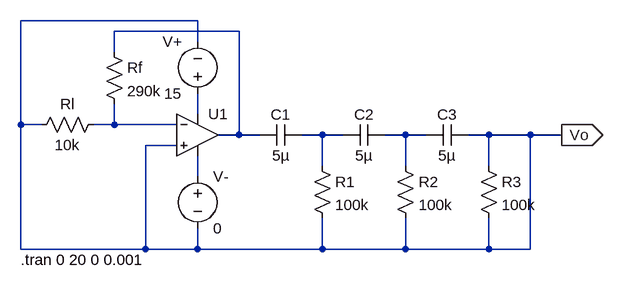
[diagram p0: schematic Oscillator - 1.asc]
Oscillator - 1.asc, the LTspice schematic file:
Version 4.1
SHEET 1 880 680
WIRE 144 -16 -128 -16
WIRE 208 0 16 0
WIRE 144 16 144 -16
WIRE 16 32 16 0
WIRE 144 128 144 96
WIRE -128 144 -128 -16
WIRE -96 144 -128 144
WIRE 16 144 16 112
WIRE 16 144 -16 144
WIRE 112 144 16 144
WIRE 208 160 208 0
WIRE 208 160 176 160
WIRE 240 160 208 160
WIRE 336 160 304 160
WIRE 368 160 336 160
WIRE 464 160 432 160
WIRE 496 160 464 160
WIRE 592 160 560 160
WIRE 656 160 592 160
WIRE 704 160 656 160
WIRE 112 176 64 176
WIRE 336 208 336 160
WIRE 464 208 464 160
WIRE 592 208 592 160
WIRE 144 224 144 192
WIRE -128 336 -128 144
WIRE 64 336 64 176
WIRE 64 336 -128 336
WIRE 144 336 144 304
WIRE 144 336 64 336
WIRE 336 336 336 288
WIRE 336 336 144 336
WIRE 464 336 464 288
WIRE 464 336 336 336
WIRE 592 336 592 288
WIRE 592 336 464 336
WIRE 656 336 656 160
WIRE 656 336 592 336
FLAG 704 160 Vo
IOPIN 704 160 Out
SYMBOL OpAmps\\UniversalOpAmp 144 160 R0
SYMATTR InstName U1
SYMBOL cap 304 144 R90
WINDOW 0 0 32 VBottom 2
WINDOW 3 32 32 VTop 2
SYMATTR InstName C1
SYMATTR Value 5µ
SYMBOL cap 432 144 R90
WINDOW 0 0 32 VBottom 2
WINDOW 3 32 32 VTop 2
SYMATTR InstName C2
SYMATTR Value 5µ
SYMBOL cap 560 144 R90
WINDOW 0 0 32 VBottom 2
WINDOW 3 32 32 VTop 2
SYMATTR InstName C3
SYMATTR Value 5µ
SYMBOL res 320 192 R0
SYMATTR InstName R1
SYMATTR Value 100k
SYMBOL res 448 192 R0
SYMATTR InstName R2
SYMATTR Value 100k
SYMBOL res 576 192 R0
SYMATTR InstName R3
SYMATTR Value 100k
SYMBOL res 0 128 R90
WINDOW 0 0 56 VBottom 2
WINDOW 3 32 56 VTop 2
SYMATTR InstName Rl
SYMATTR Value 10k
SYMBOL voltage 144 208 R0
WINDOW 123 0 0 Left 0
WINDOW 39 0 0 Left 0
SYMATTR InstName V-
SYMATTR Value 0
SYMBOL voltage 144 112 R180
WINDOW 0 24 96 Left 2
WINDOW 3 24 16 Left 2
WINDOW 123 0 0 Left 0
WINDOW 39 0 0 Left 0
SYMATTR InstName V+
SYMATTR Value 15
SYMBOL res 0 16 R0
SYMATTR InstName Rf
SYMATTR Value 290k
TEXT -128 352 Left 2 !.tran 0 20 0 0.001

The netlist it stands for:
* Oscillator - 1.asc
X§U1 Vo N003 N002 N006 N001 level1 Avol=1Meg GBW=10Meg Vos=0 En=0 Enk=0 In=0 Ink=0 Rin=500Meg  ; pins In+ In- V+ V- OUT
C1 N004 N001 5µ
C2 N005 N004 5µ
C3 Vo N005 5µ
R1 N004 Vo 100k
R2 N005 Vo 100k
R3 Vo Vo 100k
Rl N003 Vo 10k
V- N006 Vo 0
V+ N002 Vo 15
Rf N001 N003 290k
.tran 0 20 0 0.001
.lib UniversalOpAmp1.lib
.backanno
.end